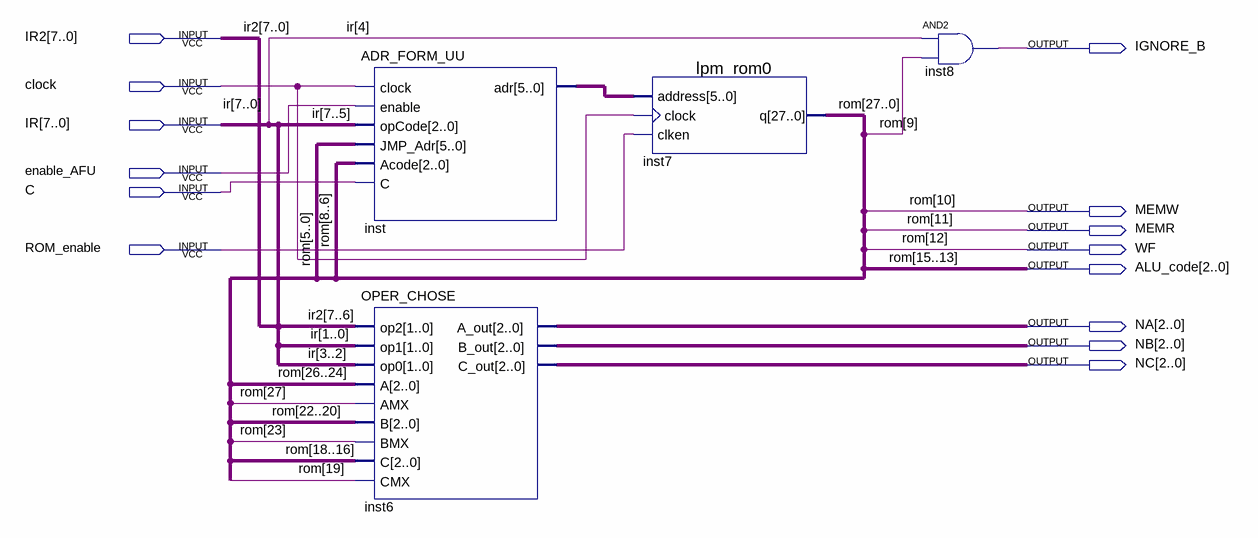
[diagram p0: schematic sheet]
// Quartus schematic UU.bdf as structural Verilog: 4 symbols, 14 pins
module UU (
  input  [7:0] IR2,
  input  clock,
  input  [7:0] IR,
  input  enable_AFU,
  input  C,
  input  ROM_enable,
  output IGNORE_B,
  output MEMW,
  output MEMR,
  output WF,
  output [2:0] ALU_code,
  output [2:0] NA,
  output [2:0] NB,
  output [2:0] NC
);

  wire [5:0] inst_adr;
  wire [27:0] rom;

  ADR_FORM_UU inst (
    .clock(clock), .enable(enable_AFU), .opCode(IR[7:5]), .JMP_Adr(rom[5:0]), .Acode(rom[8:6]), .C(C),
    .adr(inst_adr));
  OPER_CHOSE inst6 (
    .op2(IR2[7:6]), .op1(IR[1:0]), .op0(IR[3:2]), .A(rom[26:24]), .AMX(rom[27]), .B(rom[22:20]),
    .BMX(rom[23]), .C(rom[18:16]), .CMX(rom[19]), .A_out(NA), .B_out(NB), .C_out(NC));
  lpm_rom0 inst7 (
    .address(inst_adr), .clock(clock), .clken(ROM_enable),
    .q({rom[27:16], ALU_code, WF, MEMR, MEMW, rom[9:0]}));
  and inst8 (IGNORE_B, IR[4], rom[9]);

  // Other names for the same wires on the sheet: rom[15:10] = {ALU_code, WF, MEMR, MEMW}
endmodule
